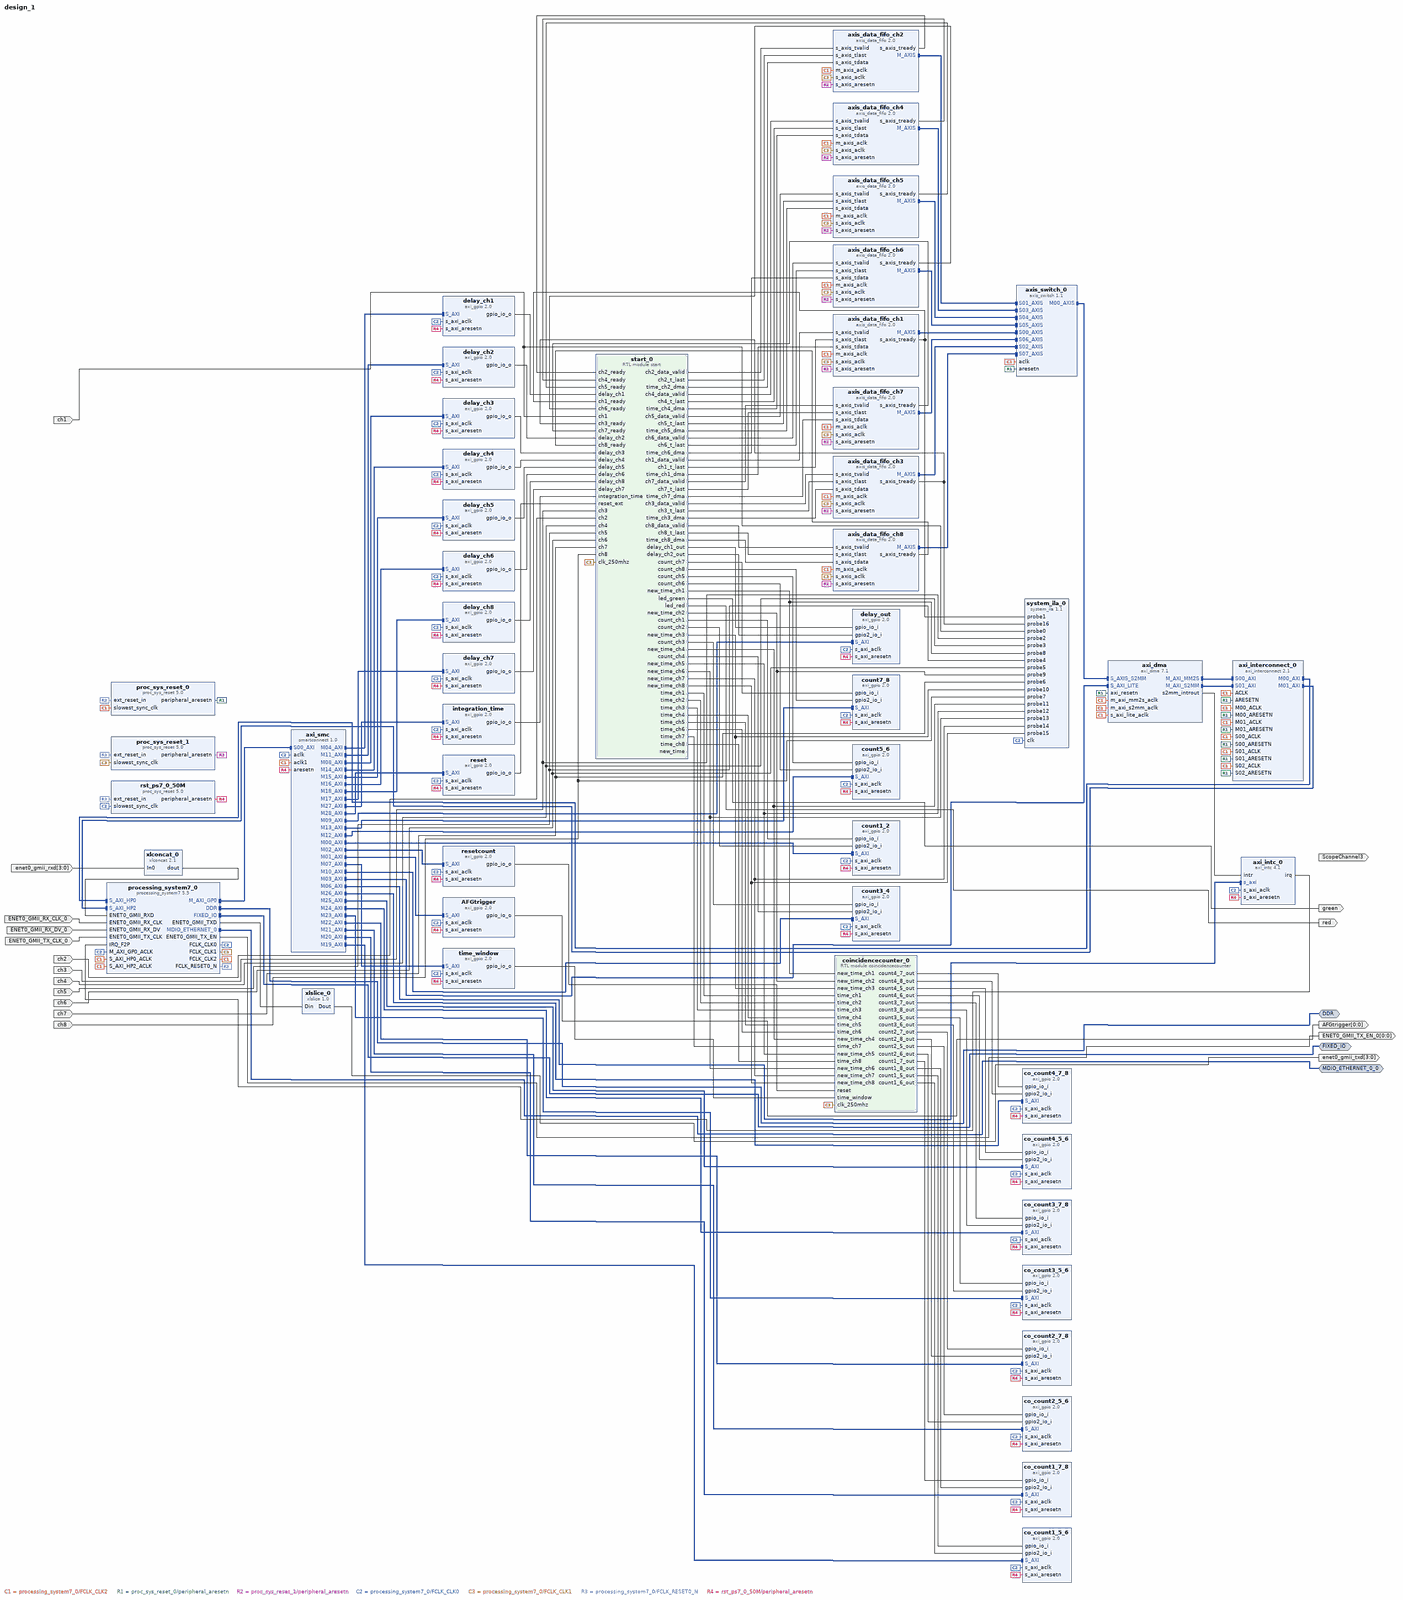
[diagram p0: block diagram of the top level, whole]
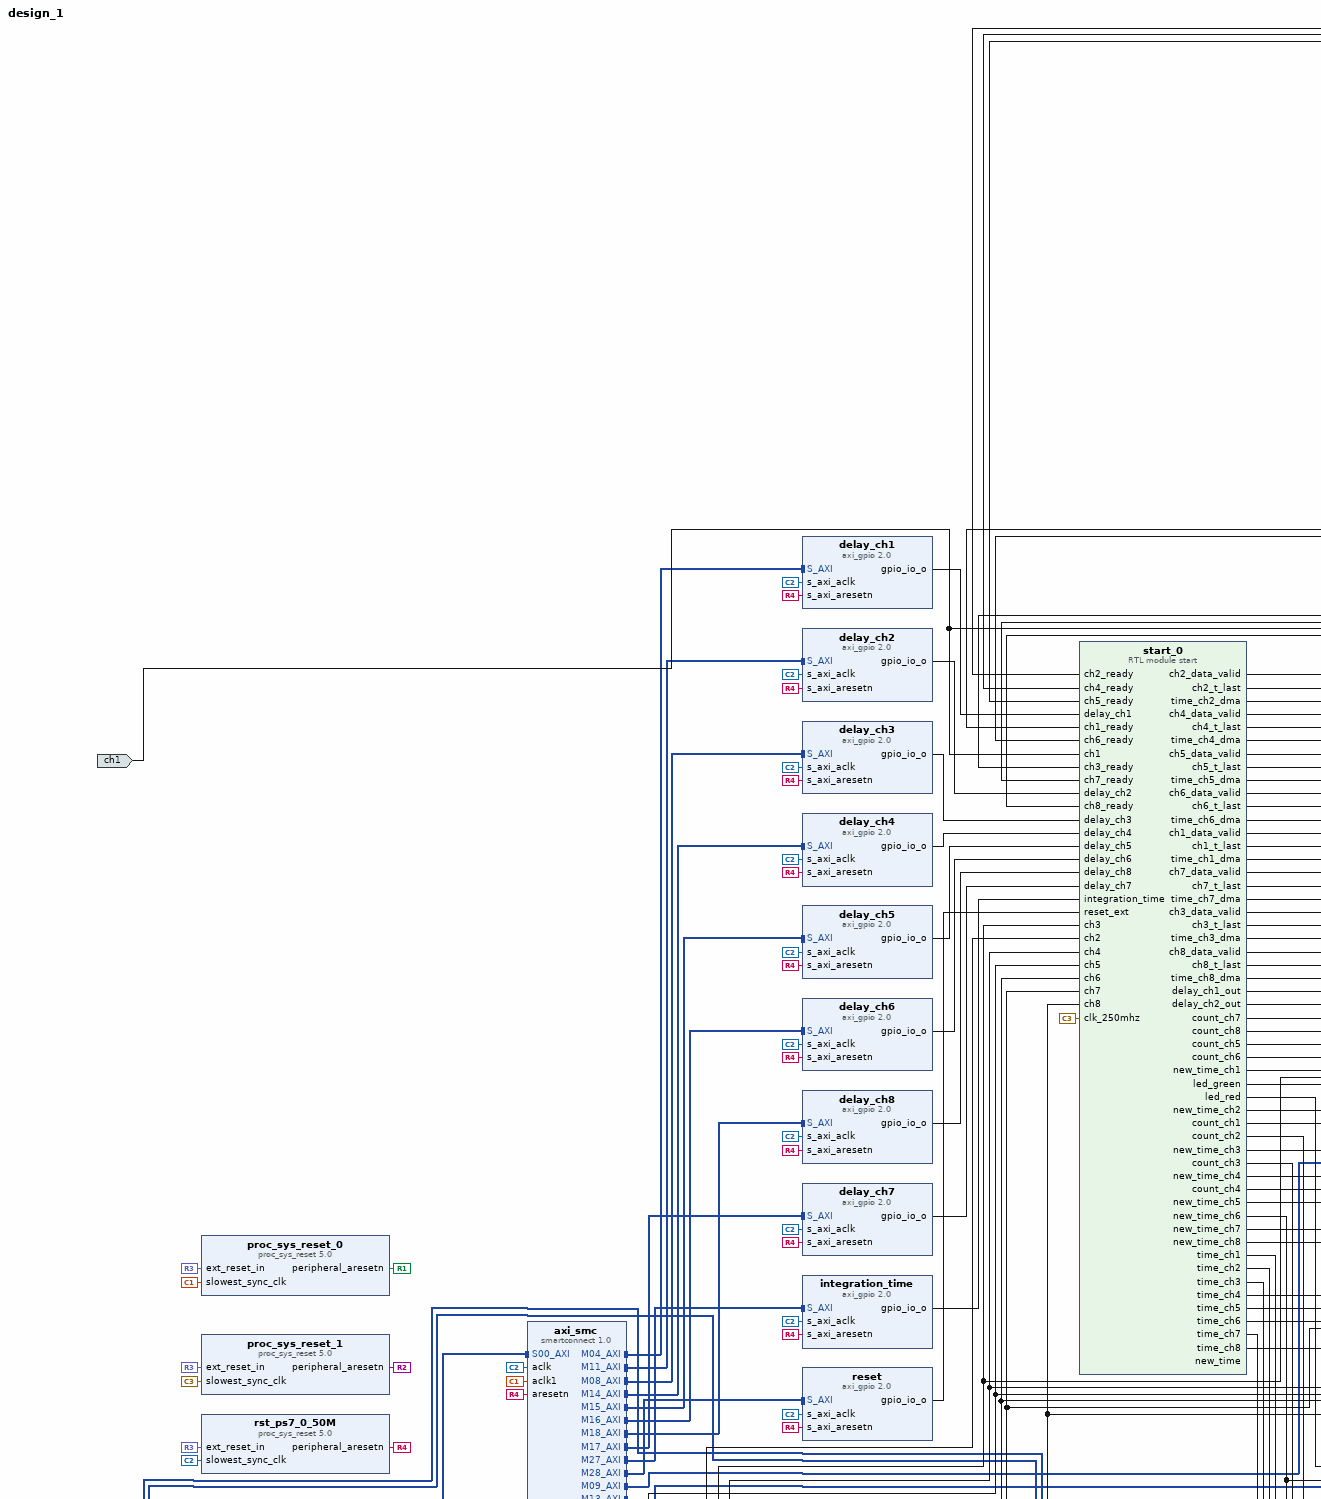
[diagram p1: block diagram of the top level, upper left part]
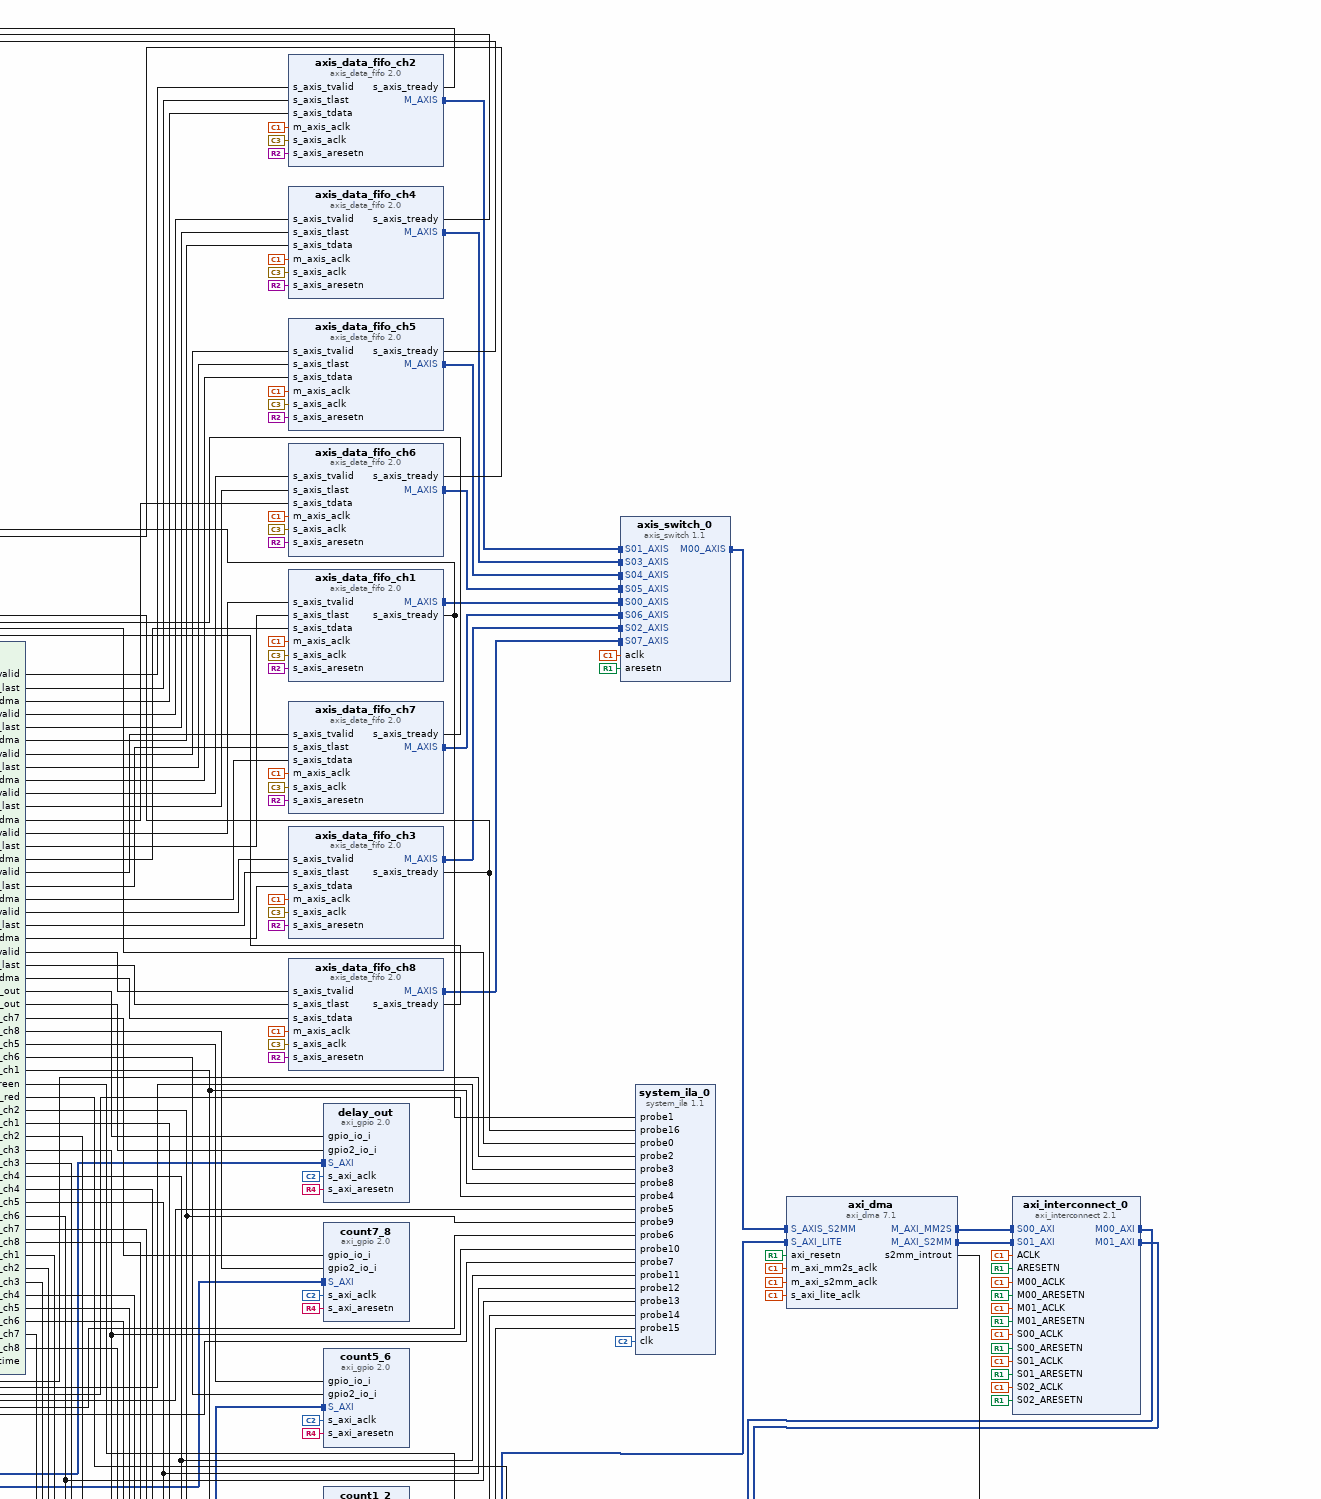
[diagram p2: block diagram of the top level, upper right part]
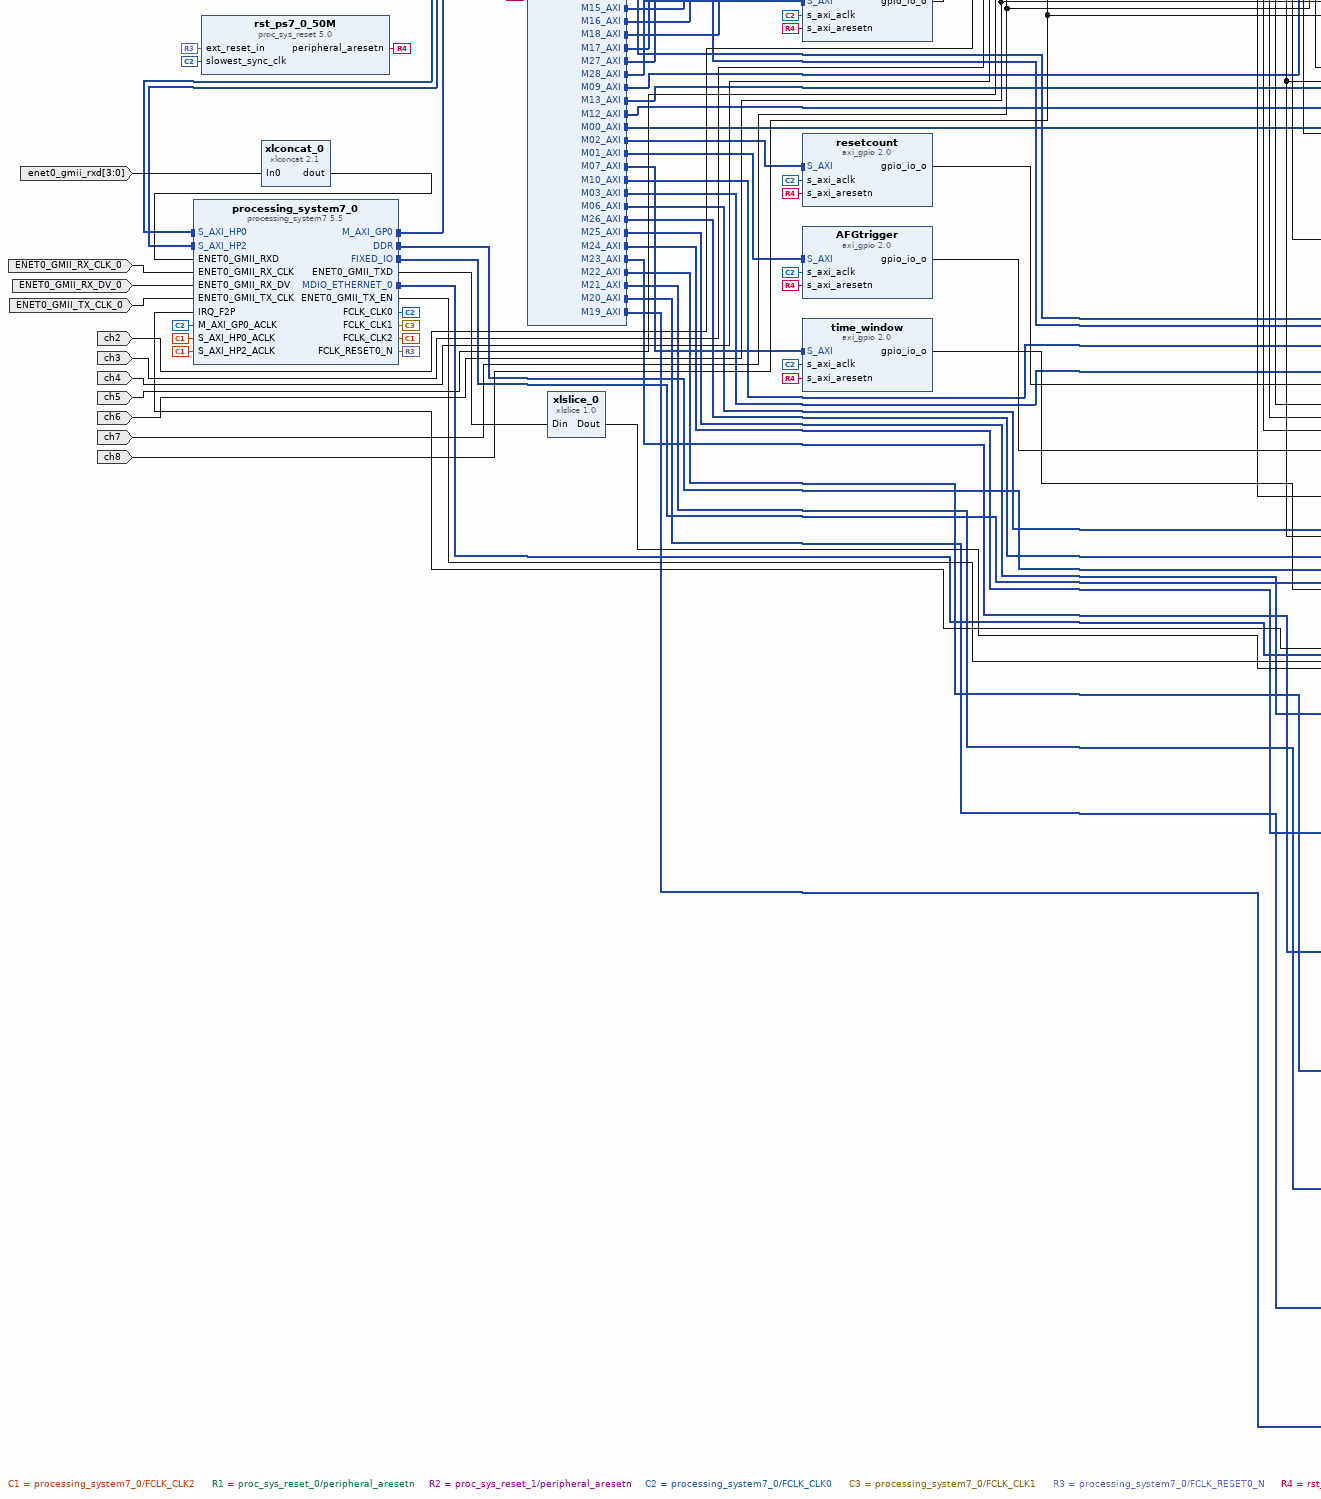
[diagram p3: block diagram of the top level, lower left part]
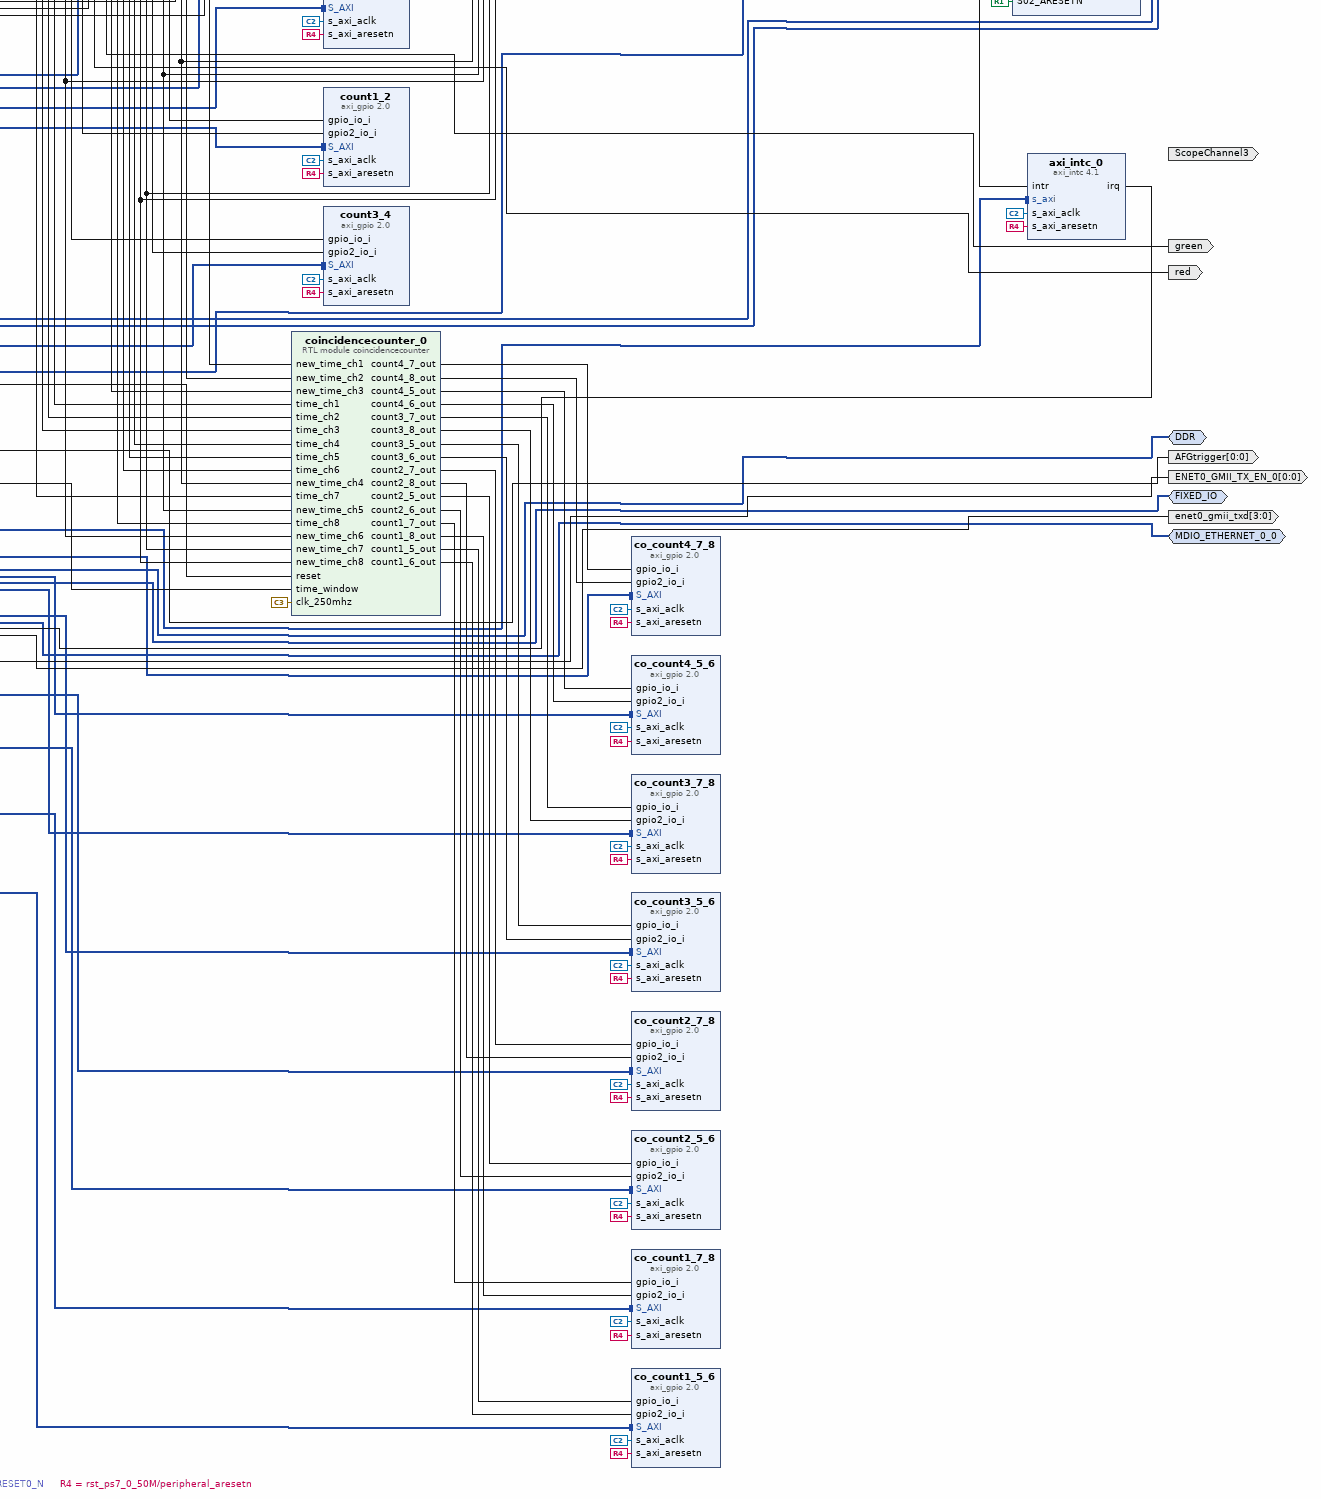
[diagram p4: block diagram of the top level, lower right part]
# Vivado block design design_1, xc7z010clg400-1, Vivado 2025.1
create_bd_design design_1

create_bd_intf_port -mode Master -vlnv xilinx.com:interface:mdio_rtl:1.0 MDIO_ETHERNET_0_0
create_bd_intf_port -mode Master -vlnv xilinx.com:interface:ddrx_rtl:1.0 DDR
create_bd_intf_port -mode Master -vlnv xilinx.com:display_processing_system7:fixedio_rtl:1.0 FIXED_IO
create_bd_port -dir O -from 0 -to 0 ENET0_GMII_TX_EN_0
create_bd_port -dir I -type clk ENET0_GMII_TX_CLK_0
set_property -dict {CONFIG.FREQ_HZ 100000000} [get_bd_ports ENET0_GMII_TX_CLK_0]
create_bd_port -dir I -from 3 -to 0 enet0_gmii_rxd
create_bd_port -dir I ENET0_GMII_RX_DV_0
create_bd_port -dir O -from 3 -to 0 enet0_gmii_txd
create_bd_port -dir I -type clk ENET0_GMII_RX_CLK_0
create_bd_port -dir O green
create_bd_port -dir O red
create_bd_port -dir O ScopeChannel3
create_bd_port -dir O -from 0 -to 0 AFGtrigger
create_bd_port -dir I ch1
create_bd_port -dir I ch2
create_bd_port -dir I ch3
create_bd_port -dir I ch4
create_bd_port -dir I ch5
create_bd_port -dir I ch6
create_bd_port -dir I ch7
create_bd_port -dir I ch8

create_bd_cell -type ip -vlnv xilinx.com:ip:processing_system7:5.5 processing_system7_0
set_property -dict [list \
  CONFIG.PCW_ENET0_ENET0_IO EMIO \
  CONFIG.PCW_ENET0_GRP_MDIO_ENABLE 1 \
  CONFIG.PCW_ENET0_GRP_MDIO_IO EMIO \
  CONFIG.PCW_ENET0_PERIPHERAL_ENABLE 1 \
  CONFIG.PCW_ENET0_PERIPHERAL_FREQMHZ {100 Mbps} \
  CONFIG.PCW_ENET_RESET_ENABLE 0 \
  CONFIG.PCW_EN_CLK1_PORT 1 \
  CONFIG.PCW_EN_CLK2_PORT 1 \
  CONFIG.PCW_FCLK_CLK0_BUF FALSE \
  CONFIG.PCW_FCLK_CLK2_BUF TRUE \
  CONFIG.PCW_FPGA0_PERIPHERAL_FREQMHZ 50 \
  CONFIG.PCW_FPGA1_PERIPHERAL_FREQMHZ 250 \
  CONFIG.PCW_FPGA2_PERIPHERAL_FREQMHZ 125 \
  CONFIG.PCW_FPGA3_PERIPHERAL_FREQMHZ 25 \
  CONFIG.PCW_FPGA_FCLK1_ENABLE 1 \
  CONFIG.PCW_FPGA_FCLK2_ENABLE 1 \
  CONFIG.PCW_GPIO_MIO_GPIO_ENABLE 1 \
  CONFIG.PCW_GPIO_MIO_GPIO_IO MIO \
  CONFIG.PCW_I2C_RESET_ENABLE 0 \
  CONFIG.PCW_IRQ_F2P_INTR 1 \
  CONFIG.PCW_NAND_NAND_IO {MIO 0 2.. 14} \
  CONFIG.PCW_NAND_PERIPHERAL_ENABLE 1 \
  CONFIG.PCW_SD0_GRP_CD_ENABLE 0 \
  CONFIG.PCW_SD0_GRP_WP_ENABLE 0 \
  CONFIG.PCW_SD0_PERIPHERAL_ENABLE 1 \
  CONFIG.PCW_SD0_SD0_IO {MIO 40 .. 45} \
  CONFIG.PCW_SDIO_PERIPHERAL_FREQMHZ 100 \
  CONFIG.PCW_UART1_PERIPHERAL_ENABLE 1 \
  CONFIG.PCW_UART1_UART1_IO {MIO 24 .. 25} \
  CONFIG.PCW_UART_PERIPHERAL_FREQMHZ 100 \
  CONFIG.PCW_UIPARAM_DDR_BUS_WIDTH {16 Bit} \
  CONFIG.PCW_UIPARAM_DDR_PARTNO {MT41K128M16 HA-15E} \
  CONFIG.PCW_USB_RESET_ENABLE 0 \
  CONFIG.PCW_USE_FABRIC_INTERRUPT 1 \
  CONFIG.PCW_USE_S_AXI_HP0 1 \
  CONFIG.PCW_USE_S_AXI_HP2 1 \
] [get_bd_cells processing_system7_0]
# 212 more settings of processing_system7_0 are not shown: defaults, MIO pin electricals, DDR timing, and values the tool derives
create_bd_cell -type ip -vlnv xilinx.com:ip:xlslice:1.0 xlslice_0
set_property -dict {CONFIG.DIN_FROM 3 CONFIG.DIN_WIDTH 8} [get_bd_cells xlslice_0]
create_bd_cell -type ip -vlnv xilinx.com:ip:xlconcat:2.1 xlconcat_0
set_property -dict {CONFIG.IN0_WIDTH 4 CONFIG.IN1_WIDTH 4} [get_bd_cells xlconcat_0]
create_bd_cell -type module -reference start start_0
create_bd_cell -type ip -vlnv xilinx.com:ip:proc_sys_reset:5.0 rst_ps7_0_50M
create_bd_cell -type ip -vlnv xilinx.com:ip:axi_gpio:2.0 delay_ch1
set_property -dict [list \
  CONFIG.C_ALL_INPUTS 0 \
  CONFIG.C_ALL_OUTPUTS 1 \
  CONFIG.C_GPIO_WIDTH 21 \
  CONFIG.C_IS_DUAL 0 \
] [get_bd_cells delay_ch1]
create_bd_cell -type ip -vlnv xilinx.com:ip:axi_gpio:2.0 delay_out
set_property -dict [list \
  CONFIG.C_ALL_INPUTS 1 \
  CONFIG.C_ALL_INPUTS_2 1 \
  CONFIG.C_GPIO2_WIDTH 21 \
  CONFIG.C_GPIO_WIDTH 21 \
  CONFIG.C_IS_DUAL 1 \
] [get_bd_cells delay_out]
create_bd_cell -type ip -vlnv xilinx.com:ip:axi_gpio:2.0 AFGtrigger
set_property -dict [list \
  CONFIG.C_DOUT_DEFAULT 0x00000000 \
  CONFIG.C_GPIO_WIDTH 1 \
  CONFIG.GPIO_BOARD_INTERFACE Custom \
  CONFIG.USE_BOARD_FLOW true \
] [get_bd_cells AFGtrigger]
create_bd_cell -type ip -vlnv xilinx.com:ip:axi_gpio:2.0 count1_2
set_property -dict [list \
  CONFIG.C_ALL_INPUTS 1 \
  CONFIG.C_ALL_INPUTS_2 1 \
  CONFIG.C_GPIO2_WIDTH 22 \
  CONFIG.C_GPIO_WIDTH 22 \
  CONFIG.C_IS_DUAL 1 \
] [get_bd_cells count1_2]
create_bd_cell -type ip -vlnv xilinx.com:ip:axi_gpio:2.0 resetcount
set_property -dict [list \
  CONFIG.C_ALL_INPUTS 0 \
  CONFIG.C_ALL_OUTPUTS 1 \
  CONFIG.C_DOUT_DEFAULT 0x00000000 \
  CONFIG.C_GPIO_WIDTH 1 \
  CONFIG.GPIO_BOARD_INTERFACE Custom \
  CONFIG.USE_BOARD_FLOW true \
] [get_bd_cells resetcount]
create_bd_cell -type ip -vlnv xilinx.com:ip:axi_gpio:2.0 time_window
set_property -dict {CONFIG.C_ALL_INPUTS 0 CONFIG.C_ALL_OUTPUTS 1 CONFIG.C_GPIO_WIDTH 21} [get_bd_cells time_window]
create_bd_cell -type ip -vlnv xilinx.com:ip:axi_gpio:2.0 delay_ch2
set_property -dict {CONFIG.C_ALL_INPUTS 0 CONFIG.C_ALL_OUTPUTS 1 CONFIG.C_GPIO_WIDTH 21} [get_bd_cells delay_ch2]
create_bd_cell -type ip -vlnv xilinx.com:ip:smartconnect:1.0 axi_smc
set_property -dict {CONFIG.NUM_CLKS 2 CONFIG.NUM_MI 29 CONFIG.NUM_SI 1} [get_bd_cells axi_smc]
create_bd_cell -type module -reference coincidencecounter coincidencecounter_0
create_bd_cell -type ip -vlnv xilinx.com:ip:axi_dma:7.1 axi_dma
set_property -dict [list \
  CONFIG.c_include_mm2s_dre 0 \
  CONFIG.c_include_sg 0 \
  CONFIG.c_m_axi_mm2s_data_width 64 \
  CONFIG.c_m_axi_s2mm_data_width 64 \
  CONFIG.c_m_axis_mm2s_tdata_width 32 \
  CONFIG.c_mm2s_burst_size 8 \
  CONFIG.c_s2mm_burst_size 16 \
  CONFIG.c_s_axis_s2mm_tdata_width 64 \
  CONFIG.c_sg_length_width 26 \
] [get_bd_cells axi_dma]
create_bd_cell -type ip -vlnv xilinx.com:ip:proc_sys_reset:5.0 proc_sys_reset_0
create_bd_cell -type ip -vlnv xilinx.com:ip:proc_sys_reset:5.0 proc_sys_reset_1
create_bd_cell -type ip -vlnv xilinx.com:ip:axis_switch:1.1 axis_switch_0
set_property -dict {CONFIG.NUM_SI 8} [get_bd_cells axis_switch_0]
create_bd_cell -type ip -vlnv xilinx.com:ip:axi_interconnect:2.1 axi_interconnect_0
set_property -dict {CONFIG.NUM_MI 2 CONFIG.NUM_SI 3} [get_bd_cells axi_interconnect_0]
create_bd_cell -type ip -vlnv xilinx.com:ip:axis_data_fifo:2.0 axis_data_fifo_ch1
set_property -dict [list \
  CONFIG.ACLKEN_CONV_MODE 0 \
  CONFIG.FIFO_DEPTH 32 \
  CONFIG.HAS_TLAST 1 \
  CONFIG.IS_ACLK_ASYNC 1 \
  CONFIG.TDATA_NUM_BYTES 8 \
] [get_bd_cells axis_data_fifo_ch1]
create_bd_cell -type ip -vlnv xilinx.com:ip:axis_data_fifo:2.0 axis_data_fifo_ch2
set_property -dict [list \
  CONFIG.FIFO_DEPTH 32 \
  CONFIG.HAS_TLAST 1 \
  CONFIG.IS_ACLK_ASYNC 1 \
  CONFIG.TDATA_NUM_BYTES 8 \
] [get_bd_cells axis_data_fifo_ch2]
create_bd_cell -type ip -vlnv xilinx.com:ip:axi_intc:4.1 axi_intc_0
create_bd_cell -type ip -vlnv xilinx.com:ip:axi_gpio:2.0 delay_ch3
set_property -dict {CONFIG.C_ALL_OUTPUTS 1 CONFIG.C_GPIO_WIDTH 21} [get_bd_cells delay_ch3]
create_bd_cell -type ip -vlnv xilinx.com:ip:axi_gpio:2.0 delay_ch4
set_property -dict {CONFIG.C_ALL_OUTPUTS 1 CONFIG.C_GPIO_WIDTH 21} [get_bd_cells delay_ch4]
create_bd_cell -type ip -vlnv xilinx.com:ip:axi_gpio:2.0 delay_ch5
set_property -dict {CONFIG.C_ALL_OUTPUTS 1 CONFIG.C_GPIO_WIDTH 21} [get_bd_cells delay_ch5]
create_bd_cell -type ip -vlnv xilinx.com:ip:axi_gpio:2.0 delay_ch6
set_property -dict {CONFIG.C_ALL_OUTPUTS 1 CONFIG.C_GPIO_WIDTH 21} [get_bd_cells delay_ch6]
create_bd_cell -type ip -vlnv xilinx.com:ip:axi_gpio:2.0 delay_ch7
set_property -dict {CONFIG.C_ALL_OUTPUTS 1 CONFIG.C_GPIO_WIDTH 21} [get_bd_cells delay_ch7]
create_bd_cell -type ip -vlnv xilinx.com:ip:axi_gpio:2.0 delay_ch8
set_property -dict {CONFIG.C_ALL_OUTPUTS 1 CONFIG.C_GPIO_WIDTH 21} [get_bd_cells delay_ch8]
create_bd_cell -type ip -vlnv xilinx.com:ip:axi_gpio:2.0 count3_4
set_property -dict [list \
  CONFIG.C_ALL_INPUTS 1 \
  CONFIG.C_ALL_INPUTS_2 1 \
  CONFIG.C_GPIO2_WIDTH 22 \
  CONFIG.C_GPIO_WIDTH 22 \
  CONFIG.C_IS_DUAL 1 \
] [get_bd_cells count3_4]
create_bd_cell -type ip -vlnv xilinx.com:ip:axi_gpio:2.0 count5_6
set_property -dict [list \
  CONFIG.C_ALL_INPUTS 1 \
  CONFIG.C_ALL_INPUTS_2 1 \
  CONFIG.C_GPIO2_WIDTH 22 \
  CONFIG.C_GPIO_WIDTH 22 \
  CONFIG.C_IS_DUAL 1 \
] [get_bd_cells count5_6]
create_bd_cell -type ip -vlnv xilinx.com:ip:axi_gpio:2.0 count7_8
set_property -dict [list \
  CONFIG.C_ALL_INPUTS 1 \
  CONFIG.C_ALL_INPUTS_2 1 \
  CONFIG.C_GPIO2_WIDTH 22 \
  CONFIG.C_GPIO_WIDTH 22 \
  CONFIG.C_IS_DUAL 1 \
] [get_bd_cells count7_8]
create_bd_cell -type ip -vlnv xilinx.com:ip:axi_gpio:2.0 co_count1_5_6
set_property -dict [list \
  CONFIG.C_ALL_INPUTS 1 \
  CONFIG.C_ALL_INPUTS_2 1 \
  CONFIG.C_GPIO2_WIDTH 22 \
  CONFIG.C_GPIO_WIDTH 22 \
  CONFIG.C_IS_DUAL 1 \
] [get_bd_cells co_count1_5_6]
create_bd_cell -type ip -vlnv xilinx.com:ip:axi_gpio:2.0 co_count1_7_8
set_property -dict [list \
  CONFIG.C_ALL_INPUTS 1 \
  CONFIG.C_ALL_INPUTS_2 1 \
  CONFIG.C_GPIO2_WIDTH 22 \
  CONFIG.C_GPIO_WIDTH 22 \
  CONFIG.C_IS_DUAL 1 \
] [get_bd_cells co_count1_7_8]
create_bd_cell -type ip -vlnv xilinx.com:ip:axi_gpio:2.0 co_count2_5_6
set_property -dict [list \
  CONFIG.C_ALL_INPUTS 1 \
  CONFIG.C_ALL_INPUTS_2 1 \
  CONFIG.C_GPIO2_WIDTH 22 \
  CONFIG.C_GPIO_WIDTH 22 \
  CONFIG.C_IS_DUAL 1 \
] [get_bd_cells co_count2_5_6]
create_bd_cell -type ip -vlnv xilinx.com:ip:axi_gpio:2.0 co_count2_7_8
set_property -dict [list \
  CONFIG.C_ALL_INPUTS 1 \
  CONFIG.C_ALL_INPUTS_2 1 \
  CONFIG.C_GPIO2_WIDTH 22 \
  CONFIG.C_GPIO_WIDTH 22 \
  CONFIG.C_IS_DUAL 1 \
] [get_bd_cells co_count2_7_8]
create_bd_cell -type ip -vlnv xilinx.com:ip:axi_gpio:2.0 co_count3_5_6
set_property -dict [list \
  CONFIG.C_ALL_INPUTS 1 \
  CONFIG.C_ALL_INPUTS_2 1 \
  CONFIG.C_GPIO2_WIDTH 22 \
  CONFIG.C_GPIO_WIDTH 22 \
  CONFIG.C_IS_DUAL 1 \
] [get_bd_cells co_count3_5_6]
create_bd_cell -type ip -vlnv xilinx.com:ip:axi_gpio:2.0 co_count3_7_8
set_property -dict [list \
  CONFIG.C_ALL_INPUTS 1 \
  CONFIG.C_ALL_INPUTS_2 1 \
  CONFIG.C_GPIO2_WIDTH 22 \
  CONFIG.C_GPIO_WIDTH 22 \
  CONFIG.C_IS_DUAL 1 \
] [get_bd_cells co_count3_7_8]
create_bd_cell -type ip -vlnv xilinx.com:ip:axi_gpio:2.0 co_count4_5_6
set_property -dict [list \
  CONFIG.C_ALL_INPUTS 1 \
  CONFIG.C_ALL_INPUTS_2 1 \
  CONFIG.C_GPIO2_WIDTH 22 \
  CONFIG.C_GPIO_WIDTH 22 \
  CONFIG.C_IS_DUAL 1 \
] [get_bd_cells co_count4_5_6]
create_bd_cell -type ip -vlnv xilinx.com:ip:axi_gpio:2.0 co_count4_7_8
set_property -dict [list \
  CONFIG.C_ALL_INPUTS 1 \
  CONFIG.C_ALL_INPUTS_2 1 \
  CONFIG.C_GPIO2_WIDTH 22 \
  CONFIG.C_GPIO_WIDTH 22 \
  CONFIG.C_IS_DUAL 1 \
] [get_bd_cells co_count4_7_8]
create_bd_cell -type ip -vlnv xilinx.com:ip:axis_data_fifo:2.0 axis_data_fifo_ch3
set_property -dict [list \
  CONFIG.ACLKEN_CONV_MODE 0 \
  CONFIG.FIFO_DEPTH 32 \
  CONFIG.HAS_TLAST 1 \
  CONFIG.IS_ACLK_ASYNC 1 \
  CONFIG.TDATA_NUM_BYTES 8 \
] [get_bd_cells axis_data_fifo_ch3]
create_bd_cell -type ip -vlnv xilinx.com:ip:axis_data_fifo:2.0 axis_data_fifo_ch4
set_property -dict [list \
  CONFIG.ACLKEN_CONV_MODE 0 \
  CONFIG.FIFO_DEPTH 32 \
  CONFIG.HAS_TLAST 1 \
  CONFIG.IS_ACLK_ASYNC 1 \
  CONFIG.TDATA_NUM_BYTES 8 \
] [get_bd_cells axis_data_fifo_ch4]
create_bd_cell -type ip -vlnv xilinx.com:ip:axis_data_fifo:2.0 axis_data_fifo_ch5
set_property -dict [list \
  CONFIG.ACLKEN_CONV_MODE 0 \
  CONFIG.FIFO_DEPTH 32 \
  CONFIG.HAS_TLAST 1 \
  CONFIG.IS_ACLK_ASYNC 1 \
  CONFIG.TDATA_NUM_BYTES 8 \
] [get_bd_cells axis_data_fifo_ch5]
create_bd_cell -type ip -vlnv xilinx.com:ip:axis_data_fifo:2.0 axis_data_fifo_ch6
set_property -dict [list \
  CONFIG.ACLKEN_CONV_MODE 0 \
  CONFIG.FIFO_DEPTH 32 \
  CONFIG.HAS_TLAST 1 \
  CONFIG.IS_ACLK_ASYNC 1 \
  CONFIG.TDATA_NUM_BYTES 8 \
] [get_bd_cells axis_data_fifo_ch6]
create_bd_cell -type ip -vlnv xilinx.com:ip:axis_data_fifo:2.0 axis_data_fifo_ch7
set_property -dict [list \
  CONFIG.ACLKEN_CONV_MODE 0 \
  CONFIG.FIFO_DEPTH 32 \
  CONFIG.HAS_TLAST 1 \
  CONFIG.IS_ACLK_ASYNC 1 \
  CONFIG.TDATA_NUM_BYTES 8 \
] [get_bd_cells axis_data_fifo_ch7]
create_bd_cell -type ip -vlnv xilinx.com:ip:axis_data_fifo:2.0 axis_data_fifo_ch8
set_property -dict [list \
  CONFIG.ACLKEN_CONV_MODE 0 \
  CONFIG.FIFO_DEPTH 32 \
  CONFIG.HAS_TLAST 1 \
  CONFIG.IS_ACLK_ASYNC 1 \
  CONFIG.TDATA_NUM_BYTES 8 \
] [get_bd_cells axis_data_fifo_ch8]
create_bd_cell -type ip -vlnv xilinx.com:ip:axi_gpio:2.0 reset
set_property -dict {CONFIG.C_ALL_OUTPUTS 1 CONFIG.C_GPIO_WIDTH 1} [get_bd_cells reset]
create_bd_cell -type ip -vlnv xilinx.com:ip:axi_gpio:2.0 integration_time
set_property -dict {CONFIG.C_ALL_OUTPUTS 1} [get_bd_cells integration_time]
create_bd_cell -type ip -vlnv xilinx.com:ip:system_ila:1.1 system_ila_0
set_property -dict [list \
  CONFIG.C_MON_TYPE NATIVE \
  CONFIG.C_NUM_OF_PROBES 17 \
  CONFIG.C_PROBE0_TYPE 0 \
  CONFIG.C_PROBE10_TYPE 0 \
  CONFIG.C_PROBE11_TYPE 0 \
  CONFIG.C_PROBE12_TYPE 0 \
  CONFIG.C_PROBE13_TYPE 0 \
  CONFIG.C_PROBE14_TYPE 0 \
  CONFIG.C_PROBE15_TYPE 0 \
  CONFIG.C_PROBE16_TYPE 0 \
  CONFIG.C_PROBE1_TYPE 0 \
  CONFIG.C_PROBE2_TYPE 0 \
  CONFIG.C_PROBE3_TYPE 0 \
  CONFIG.C_PROBE4_TYPE 0 \
  CONFIG.C_PROBE5_TYPE 0 \
  CONFIG.C_PROBE6_TYPE 0 \
  CONFIG.C_PROBE7_TYPE 0 \
  CONFIG.C_PROBE8_TYPE 0 \
  CONFIG.C_PROBE9_TYPE 0 \
] [get_bd_cells system_ila_0]

# ---- connections ----

connect_bd_intf_net [get_bd_intf_pins axi_dma/M_AXI_MM2S] [get_bd_intf_pins axi_interconnect_0/S00_AXI]
connect_bd_intf_net [get_bd_intf_pins axi_dma/M_AXI_S2MM] [get_bd_intf_pins axi_interconnect_0/S01_AXI]
connect_bd_intf_net [get_bd_intf_pins axi_interconnect_0/M00_AXI] [get_bd_intf_pins processing_system7_0/S_AXI_HP0]
connect_bd_intf_net [get_bd_intf_pins processing_system7_0/S_AXI_HP2] [get_bd_intf_pins axi_interconnect_0/M01_AXI]
connect_bd_intf_net [get_bd_intf_pins axi_smc/M00_AXI] [get_bd_intf_pins count1_2/S_AXI]
connect_bd_intf_net [get_bd_intf_pins axi_smc/M01_AXI] [get_bd_intf_pins AFGtrigger/S_AXI]
connect_bd_intf_net [get_bd_intf_pins axi_smc/M02_AXI] [get_bd_intf_pins resetcount/S_AXI]
connect_bd_intf_net [get_bd_intf_pins axi_smc/M03_AXI] [get_bd_intf_pins axi_dma/S_AXI_LITE]
connect_bd_intf_net [get_bd_intf_pins axi_smc/M04_AXI] [get_bd_intf_pins delay_ch1/S_AXI]
connect_bd_intf_net [get_bd_intf_pins axi_intc_0/s_axi] [get_bd_intf_pins axi_smc/M06_AXI]
connect_bd_intf_net [get_bd_intf_pins axi_smc/M07_AXI] [get_bd_intf_pins time_window/S_AXI]
connect_bd_intf_net [get_bd_intf_pins axi_smc/M08_AXI] [get_bd_intf_pins delay_ch3/S_AXI]
connect_bd_intf_net [get_bd_intf_pins axi_smc/M09_AXI] [get_bd_intf_pins delay_out/S_AXI]
connect_bd_intf_net [get_bd_intf_pins axi_smc/M10_AXI] [get_bd_intf_pins count3_4/S_AXI]
connect_bd_intf_net [get_bd_intf_pins axi_smc/M11_AXI] [get_bd_intf_pins delay_ch2/S_AXI]
connect_bd_intf_net [get_bd_intf_pins axi_smc/M12_AXI] [get_bd_intf_pins count5_6/S_AXI]
connect_bd_intf_net [get_bd_intf_pins axi_smc/M13_AXI] [get_bd_intf_pins count7_8/S_AXI]
connect_bd_intf_net [get_bd_intf_pins axi_smc/M14_AXI] [get_bd_intf_pins delay_ch4/S_AXI]
connect_bd_intf_net [get_bd_intf_pins axi_smc/M15_AXI] [get_bd_intf_pins delay_ch5/S_AXI]
connect_bd_intf_net [get_bd_intf_pins axi_smc/M16_AXI] [get_bd_intf_pins delay_ch6/S_AXI]
connect_bd_intf_net [get_bd_intf_pins axi_smc/M17_AXI] [get_bd_intf_pins delay_ch7/S_AXI]
connect_bd_intf_net [get_bd_intf_pins axi_smc/M18_AXI] [get_bd_intf_pins delay_ch8/S_AXI]
connect_bd_intf_net [get_bd_intf_pins axi_smc/M19_AXI] [get_bd_intf_pins co_count1_5_6/S_AXI]
connect_bd_intf_net [get_bd_intf_pins axi_smc/M20_AXI] [get_bd_intf_pins co_count1_7_8/S_AXI]
connect_bd_intf_net [get_bd_intf_pins axi_smc/M21_AXI] [get_bd_intf_pins co_count2_5_6/S_AXI]
connect_bd_intf_net [get_bd_intf_pins axi_smc/M22_AXI] [get_bd_intf_pins co_count2_7_8/S_AXI]
connect_bd_intf_net [get_bd_intf_pins axi_smc/M23_AXI] [get_bd_intf_pins co_count3_5_6/S_AXI]
connect_bd_intf_net [get_bd_intf_pins axi_smc/M24_AXI] [get_bd_intf_pins co_count3_7_8/S_AXI]
connect_bd_intf_net [get_bd_intf_pins axi_smc/M25_AXI] [get_bd_intf_pins co_count4_5_6/S_AXI]
connect_bd_intf_net [get_bd_intf_pins axi_smc/M26_AXI] [get_bd_intf_pins co_count4_7_8/S_AXI]
connect_bd_intf_net [get_bd_intf_pins axi_smc/M27_AXI] [get_bd_intf_pins integration_time/S_AXI]
connect_bd_intf_net [get_bd_intf_pins axi_smc/M28_AXI] [get_bd_intf_pins reset/S_AXI]
connect_bd_intf_net -intf_net axis_data_fifo_0_M_AXIS [get_bd_intf_pins axis_data_fifo_ch1/M_AXIS] [get_bd_intf_pins axis_switch_0/S00_AXIS]
connect_bd_intf_net -intf_net axis_data_fifo_0_M_AXIS1 [get_bd_intf_pins axis_data_fifo_ch2/M_AXIS] [get_bd_intf_pins axis_switch_0/S01_AXIS]
connect_bd_intf_net [get_bd_intf_pins axis_data_fifo_ch3/M_AXIS] [get_bd_intf_pins axis_switch_0/S02_AXIS]
connect_bd_intf_net [get_bd_intf_pins axis_data_fifo_ch4/M_AXIS] [get_bd_intf_pins axis_switch_0/S03_AXIS]
connect_bd_intf_net [get_bd_intf_pins axis_data_fifo_ch5/M_AXIS] [get_bd_intf_pins axis_switch_0/S04_AXIS]
connect_bd_intf_net [get_bd_intf_pins axis_data_fifo_ch6/M_AXIS] [get_bd_intf_pins axis_switch_0/S05_AXIS]
connect_bd_intf_net [get_bd_intf_pins axis_data_fifo_ch7/M_AXIS] [get_bd_intf_pins axis_switch_0/S06_AXIS]
connect_bd_intf_net [get_bd_intf_pins axis_data_fifo_ch8/M_AXIS] [get_bd_intf_pins axis_switch_0/S07_AXIS]
connect_bd_intf_net [get_bd_intf_pins axis_switch_0/M00_AXIS] [get_bd_intf_pins axi_dma/S_AXIS_S2MM]
connect_bd_intf_net [get_bd_intf_ports DDR] [get_bd_intf_pins processing_system7_0/DDR]
connect_bd_intf_net [get_bd_intf_ports FIXED_IO] [get_bd_intf_pins processing_system7_0/FIXED_IO]
connect_bd_intf_net [get_bd_intf_ports MDIO_ETHERNET_0_0] [get_bd_intf_pins processing_system7_0/MDIO_ETHERNET_0]
connect_bd_intf_net [get_bd_intf_pins processing_system7_0/M_AXI_GP0] [get_bd_intf_pins axi_smc/S00_AXI]
connect_bd_net [get_bd_pins AFGtrigger/gpio_io_o] [get_bd_ports AFGtrigger]
connect_bd_net -net ENET0_GMII_RX_CLK_0_1 [get_bd_ports ENET0_GMII_RX_CLK_0] [get_bd_pins processing_system7_0/ENET0_GMII_RX_CLK]
connect_bd_net -net ENET0_GMII_RX_DV_0_1 [get_bd_ports ENET0_GMII_RX_DV_0] [get_bd_pins processing_system7_0/ENET0_GMII_RX_DV]
connect_bd_net -net ENET0_GMII_TX_CLK_0_1 [get_bd_ports ENET0_GMII_TX_CLK_0] [get_bd_pins processing_system7_0/ENET0_GMII_TX_CLK]
connect_bd_net -net In0_0_1 [get_bd_ports enet0_gmii_rxd] [get_bd_pins xlconcat_0/In0]
connect_bd_net [get_bd_pins processing_system7_0/FCLK_CLK2] \
  [get_bd_pins axi_dma/s_axi_lite_aclk] [get_bd_pins axi_dma/m_axi_mm2s_aclk] [get_bd_pins axi_dma/m_axi_s2mm_aclk] \
  [get_bd_pins processing_system7_0/S_AXI_HP0_ACLK] [get_bd_pins processing_system7_0/S_AXI_HP2_ACLK] \
  [get_bd_pins proc_sys_reset_0/slowest_sync_clk] [get_bd_pins axi_smc/aclk1] [get_bd_pins axis_switch_0/aclk] \
  [get_bd_pins axi_interconnect_0/S02_ACLK] [get_bd_pins axi_interconnect_0/M00_ACLK] [get_bd_pins axi_interconnect_0/ACLK] \
  [get_bd_pins axi_interconnect_0/M01_ACLK] [get_bd_pins axi_interconnect_0/S00_ACLK] \
  [get_bd_pins axi_interconnect_0/S01_ACLK] [get_bd_pins axis_data_fifo_ch1/m_axis_aclk] \
  [get_bd_pins axis_data_fifo_ch2/m_axis_aclk] [get_bd_pins axis_data_fifo_ch3/m_axis_aclk] \
  [get_bd_pins axis_data_fifo_ch4/m_axis_aclk] [get_bd_pins axis_data_fifo_ch5/m_axis_aclk] \
  [get_bd_pins axis_data_fifo_ch6/m_axis_aclk] [get_bd_pins axis_data_fifo_ch7/m_axis_aclk] \
  [get_bd_pins axis_data_fifo_ch8/m_axis_aclk]
connect_bd_net [get_bd_pins proc_sys_reset_0/peripheral_aresetn] \
  [get_bd_pins axi_dma/axi_resetn] [get_bd_pins axis_switch_0/aresetn] [get_bd_pins axi_interconnect_0/S02_ARESETN] \
  [get_bd_pins axi_interconnect_0/M00_ARESETN] [get_bd_pins axi_interconnect_0/ARESETN] \
  [get_bd_pins axi_interconnect_0/M01_ARESETN] [get_bd_pins axi_interconnect_0/S00_ARESETN] \
  [get_bd_pins axi_interconnect_0/S01_ARESETN]
connect_bd_net [get_bd_pins axi_dma/s2mm_introut] [get_bd_pins axi_intc_0/intr]
connect_bd_net -net axi_gpio_1_gpio_io_o [get_bd_pins delay_ch8/gpio_io_o] [get_bd_pins start_0/delay_ch8]
connect_bd_net [get_bd_pins axi_intc_0/irq] [get_bd_pins processing_system7_0/IRQ_F2P]
connect_bd_net -net axis_data_fifo_0_s_axis_tready [get_bd_pins axis_data_fifo_ch1/s_axis_tready] \
  [get_bd_pins system_ila_0/probe1] [get_bd_pins start_0/ch1_ready]
connect_bd_net -net axis_data_fifo_0_s_axis_tready1 [get_bd_pins axis_data_fifo_ch2/s_axis_tready] [get_bd_pins start_0/ch2_ready]
connect_bd_net -net axis_data_fifo_ch3_s_axis_tready [get_bd_pins axis_data_fifo_ch3/s_axis_tready] \
  [get_bd_pins start_0/ch3_ready] [get_bd_pins system_ila_0/probe16]
connect_bd_net [get_bd_pins axis_data_fifo_ch4/s_axis_tready] [get_bd_pins start_0/ch4_ready]
connect_bd_net [get_bd_pins axis_data_fifo_ch5/s_axis_tready] [get_bd_pins start_0/ch5_ready]
connect_bd_net [get_bd_pins axis_data_fifo_ch6/s_axis_tready] [get_bd_pins start_0/ch6_ready]
connect_bd_net [get_bd_pins axis_data_fifo_ch7/s_axis_tready] [get_bd_pins start_0/ch7_ready]
connect_bd_net [get_bd_pins axis_data_fifo_ch8/s_axis_tready] [get_bd_pins start_0/ch8_ready]
connect_bd_net -net ch1_0_1 [get_bd_ports ch1] [get_bd_pins system_ila_0/probe0] [get_bd_pins start_0/ch1]
connect_bd_net -net ch2_0_1 [get_bd_ports ch2] [get_bd_pins start_0/ch2]
connect_bd_net -net ch3_0_1 [get_bd_ports ch3] [get_bd_pins system_ila_0/probe2] [get_bd_pins start_0/ch3]
connect_bd_net -net ch4_0_1 [get_bd_ports ch4] [get_bd_pins system_ila_0/probe3] [get_bd_pins start_0/ch4]
connect_bd_net -net ch5_0_1 [get_bd_ports ch5] [get_bd_pins system_ila_0/probe4] [get_bd_pins start_0/ch5]
connect_bd_net -net ch6_0_1 [get_bd_ports ch6] [get_bd_pins system_ila_0/probe5] [get_bd_pins start_0/ch6]
connect_bd_net -net ch7_0_1 [get_bd_ports ch7] [get_bd_pins system_ila_0/probe6] [get_bd_pins start_0/ch7]
connect_bd_net -net ch8_0_1 [get_bd_ports ch8] [get_bd_pins system_ila_0/probe7] [get_bd_pins start_0/ch8]
connect_bd_net -net coincidencecounter_0_count1_5 [get_bd_pins coincidencecounter_0/count1_5_out] [get_bd_pins co_count1_5_6/gpio_io_i]
connect_bd_net -net coincidencecounter_0_count1_6 [get_bd_pins coincidencecounter_0/count1_6_out] [get_bd_pins co_count1_5_6/gpio2_io_i]
connect_bd_net -net coincidencecounter_0_count1_7 [get_bd_pins coincidencecounter_0/count1_7_out] [get_bd_pins co_count1_7_8/gpio_io_i]
connect_bd_net -net coincidencecounter_0_count1_8 [get_bd_pins coincidencecounter_0/count1_8_out] [get_bd_pins co_count1_7_8/gpio2_io_i]
connect_bd_net -net coincidencecounter_0_count2_5 [get_bd_pins coincidencecounter_0/count2_5_out] [get_bd_pins co_count2_5_6/gpio_io_i]
connect_bd_net -net coincidencecounter_0_count2_6 [get_bd_pins coincidencecounter_0/count2_6_out] [get_bd_pins co_count2_5_6/gpio2_io_i]
connect_bd_net -net coincidencecounter_0_count2_7 [get_bd_pins coincidencecounter_0/count2_7_out] [get_bd_pins co_count2_7_8/gpio_io_i]
connect_bd_net -net coincidencecounter_0_count2_8 [get_bd_pins coincidencecounter_0/count2_8_out] [get_bd_pins co_count2_7_8/gpio2_io_i]
connect_bd_net -net coincidencecounter_0_count3_5 [get_bd_pins coincidencecounter_0/count3_5_out] [get_bd_pins co_count3_5_6/gpio_io_i]
connect_bd_net -net coincidencecounter_0_count3_6 [get_bd_pins coincidencecounter_0/count3_6_out] [get_bd_pins co_count3_5_6/gpio2_io_i]
connect_bd_net -net coincidencecounter_0_count3_7 [get_bd_pins coincidencecounter_0/count3_7_out] [get_bd_pins co_count3_7_8/gpio_io_i]
connect_bd_net -net coincidencecounter_0_count3_8 [get_bd_pins coincidencecounter_0/count3_8_out] [get_bd_pins co_count3_7_8/gpio2_io_i]
connect_bd_net [get_bd_pins coincidencecounter_0/count4_5_out] [get_bd_pins co_count4_5_6/gpio_io_i]
connect_bd_net -net coincidencecounter_0_count4_6 [get_bd_pins coincidencecounter_0/count4_6_out] [get_bd_pins co_count4_5_6/gpio2_io_i]
connect_bd_net -net coincidencecounter_0_count4_7 [get_bd_pins coincidencecounter_0/count4_7_out] [get_bd_pins co_count4_7_8/gpio_io_i]
connect_bd_net -net coincidencecounter_0_count4_8 [get_bd_pins coincidencecounter_0/count4_8_out] [get_bd_pins co_count4_7_8/gpio2_io_i]
connect_bd_net [get_bd_pins delay_ch2/gpio_io_o] [get_bd_pins start_0/delay_ch2]
connect_bd_net -net delay_ch3 [get_bd_pins delay_ch3/gpio_io_o] [get_bd_pins start_0/delay_ch3]
connect_bd_net [get_bd_pins delay_ch4/gpio_io_o] [get_bd_pins start_0/delay_ch4]
connect_bd_net [get_bd_pins delay_ch5/gpio_io_o] [get_bd_pins start_0/delay_ch5]
connect_bd_net [get_bd_pins delay_ch6/gpio_io_o] [get_bd_pins start_0/delay_ch6]
connect_bd_net [get_bd_pins delay_ch7/gpio_io_o] [get_bd_pins start_0/delay_ch7]
connect_bd_net -net delay_gpio_io_o [get_bd_pins delay_ch1/gpio_io_o] [get_bd_pins start_0/delay_ch1]
connect_bd_net [get_bd_pins integration_time/gpio_io_o] [get_bd_pins start_0/integration_time]
connect_bd_net [get_bd_pins proc_sys_reset_1/peripheral_aresetn] \
  [get_bd_pins axis_data_fifo_ch1/s_axis_aresetn] [get_bd_pins axis_data_fifo_ch2/s_axis_aresetn] \
  [get_bd_pins axis_data_fifo_ch3/s_axis_aresetn] [get_bd_pins axis_data_fifo_ch4/s_axis_aresetn] \
  [get_bd_pins axis_data_fifo_ch5/s_axis_aresetn] [get_bd_pins axis_data_fifo_ch6/s_axis_aresetn] \
  [get_bd_pins axis_data_fifo_ch7/s_axis_aresetn] [get_bd_pins axis_data_fifo_ch8/s_axis_aresetn]
connect_bd_net [get_bd_pins processing_system7_0/ENET0_GMII_TXD] [get_bd_pins xlslice_0/Din]
connect_bd_net [get_bd_pins processing_system7_0/ENET0_GMII_TX_EN] [get_bd_ports ENET0_GMII_TX_EN_0]
connect_bd_net [get_bd_pins processing_system7_0/FCLK_CLK0] \
  [get_bd_pins rst_ps7_0_50M/slowest_sync_clk] [get_bd_pins axi_smc/aclk] [get_bd_pins processing_system7_0/M_AXI_GP0_ACLK] \
  [get_bd_pins delay_ch1/s_axi_aclk] [get_bd_pins resetcount/s_axi_aclk] [get_bd_pins time_window/s_axi_aclk] \
  [get_bd_pins delay_ch2/s_axi_aclk] [get_bd_pins delay_out/s_axi_aclk] [get_bd_pins count1_2/s_axi_aclk] \
  [get_bd_pins AFGtrigger/s_axi_aclk] [get_bd_pins axi_intc_0/s_axi_aclk] [get_bd_pins delay_ch3/s_axi_aclk] \
  [get_bd_pins count3_4/s_axi_aclk] [get_bd_pins count5_6/s_axi_aclk] [get_bd_pins count7_8/s_axi_aclk] \
  [get_bd_pins delay_ch4/s_axi_aclk] [get_bd_pins delay_ch5/s_axi_aclk] [get_bd_pins delay_ch6/s_axi_aclk] \
  [get_bd_pins delay_ch7/s_axi_aclk] [get_bd_pins delay_ch8/s_axi_aclk] [get_bd_pins co_count1_5_6/s_axi_aclk] \
  [get_bd_pins co_count1_7_8/s_axi_aclk] [get_bd_pins co_count2_5_6/s_axi_aclk] [get_bd_pins co_count2_7_8/s_axi_aclk] \
  [get_bd_pins co_count3_5_6/s_axi_aclk] [get_bd_pins co_count3_7_8/s_axi_aclk] [get_bd_pins co_count4_5_6/s_axi_aclk] \
  [get_bd_pins co_count4_7_8/s_axi_aclk] [get_bd_pins integration_time/s_axi_aclk] [get_bd_pins reset/s_axi_aclk] \
  [get_bd_pins system_ila_0/clk]
connect_bd_net [get_bd_pins processing_system7_0/FCLK_CLK1] \
  [get_bd_pins proc_sys_reset_1/slowest_sync_clk] [get_bd_pins axis_data_fifo_ch1/s_axis_aclk] \
  [get_bd_pins axis_data_fifo_ch2/s_axis_aclk] [get_bd_pins axis_data_fifo_ch3/s_axis_aclk] \
  [get_bd_pins axis_data_fifo_ch4/s_axis_aclk] [get_bd_pins axis_data_fifo_ch5/s_axis_aclk] \
  [get_bd_pins axis_data_fifo_ch6/s_axis_aclk] [get_bd_pins axis_data_fifo_ch7/s_axis_aclk] \
  [get_bd_pins axis_data_fifo_ch8/s_axis_aclk] [get_bd_pins coincidencecounter_0/clk_250mhz] [get_bd_pins start_0/clk_250mhz]
connect_bd_net [get_bd_pins processing_system7_0/FCLK_RESET0_N] \
  [get_bd_pins rst_ps7_0_50M/ext_reset_in] [get_bd_pins proc_sys_reset_0/ext_reset_in] \
  [get_bd_pins proc_sys_reset_1/ext_reset_in]
connect_bd_net [get_bd_pins reset/gpio_io_o] [get_bd_pins start_0/reset_ext]
connect_bd_net [get_bd_pins resetcount/gpio_io_o] [get_bd_pins coincidencecounter_0/reset]
connect_bd_net [get_bd_pins rst_ps7_0_50M/peripheral_aresetn] \
  [get_bd_pins delay_ch1/s_axi_aresetn] [get_bd_pins delay_out/s_axi_aresetn] [get_bd_pins AFGtrigger/s_axi_aresetn] \
  [get_bd_pins count1_2/s_axi_aresetn] [get_bd_pins resetcount/s_axi_aresetn] [get_bd_pins time_window/s_axi_aresetn] \
  [get_bd_pins delay_ch2/s_axi_aresetn] [get_bd_pins axi_smc/aresetn] [get_bd_pins axi_intc_0/s_axi_aresetn] \
  [get_bd_pins delay_ch3/s_axi_aresetn] [get_bd_pins count3_4/s_axi_aresetn] [get_bd_pins count5_6/s_axi_aresetn] \
  [get_bd_pins count7_8/s_axi_aresetn] [get_bd_pins delay_ch4/s_axi_aresetn] [get_bd_pins delay_ch5/s_axi_aresetn] \
  [get_bd_pins delay_ch6/s_axi_aresetn] [get_bd_pins delay_ch7/s_axi_aresetn] [get_bd_pins delay_ch8/s_axi_aresetn] \
  [get_bd_pins co_count1_5_6/s_axi_aresetn] [get_bd_pins co_count1_7_8/s_axi_aresetn] \
  [get_bd_pins co_count2_5_6/s_axi_aresetn] [get_bd_pins co_count2_7_8/s_axi_aresetn] \
  [get_bd_pins co_count3_5_6/s_axi_aresetn] [get_bd_pins co_count3_7_8/s_axi_aresetn] \
  [get_bd_pins co_count4_5_6/s_axi_aresetn] [get_bd_pins co_count4_7_8/s_axi_aresetn] \
  [get_bd_pins integration_time/s_axi_aresetn] [get_bd_pins reset/s_axi_aresetn]
# net start_0_ScopeChannel3 has one end: ScopeChannel3
connect_bd_net [get_bd_pins start_0/ch1_data_valid] [get_bd_pins axis_data_fifo_ch1/s_axis_tvalid]
connect_bd_net [get_bd_pins start_0/ch1_t_last] [get_bd_pins axis_data_fifo_ch1/s_axis_tlast]
connect_bd_net [get_bd_pins start_0/ch2_data_valid] [get_bd_pins axis_data_fifo_ch2/s_axis_tvalid]
connect_bd_net [get_bd_pins start_0/ch2_t_last] [get_bd_pins axis_data_fifo_ch2/s_axis_tlast]
connect_bd_net [get_bd_pins start_0/ch3_data_valid] [get_bd_pins axis_data_fifo_ch3/s_axis_tvalid]
connect_bd_net [get_bd_pins start_0/ch3_t_last] [get_bd_pins axis_data_fifo_ch3/s_axis_tlast]
connect_bd_net [get_bd_pins start_0/ch4_data_valid] [get_bd_pins axis_data_fifo_ch4/s_axis_tvalid]
connect_bd_net [get_bd_pins start_0/ch4_t_last] [get_bd_pins axis_data_fifo_ch4/s_axis_tlast]
connect_bd_net [get_bd_pins start_0/ch5_data_valid] [get_bd_pins axis_data_fifo_ch5/s_axis_tvalid]
connect_bd_net [get_bd_pins start_0/ch5_t_last] [get_bd_pins axis_data_fifo_ch5/s_axis_tlast]
connect_bd_net [get_bd_pins start_0/ch6_data_valid] [get_bd_pins axis_data_fifo_ch6/s_axis_tvalid]
connect_bd_net [get_bd_pins start_0/ch6_t_last] [get_bd_pins axis_data_fifo_ch6/s_axis_tlast]
connect_bd_net [get_bd_pins start_0/ch7_data_valid] [get_bd_pins axis_data_fifo_ch7/s_axis_tvalid]
connect_bd_net [get_bd_pins start_0/ch7_t_last] [get_bd_pins axis_data_fifo_ch7/s_axis_tlast]
connect_bd_net [get_bd_pins start_0/ch8_data_valid] [get_bd_pins axis_data_fifo_ch8/s_axis_tvalid]
connect_bd_net [get_bd_pins start_0/ch8_t_last] [get_bd_pins axis_data_fifo_ch8/s_axis_tlast]
connect_bd_net [get_bd_pins start_0/count_ch1] [get_bd_pins count1_2/gpio_io_i]
connect_bd_net [get_bd_pins start_0/count_ch2] [get_bd_pins count1_2/gpio2_io_i]
connect_bd_net [get_bd_pins start_0/count_ch3] [get_bd_pins count3_4/gpio_io_i]
connect_bd_net [get_bd_pins start_0/count_ch4] [get_bd_pins count3_4/gpio2_io_i]
connect_bd_net [get_bd_pins start_0/count_ch5] [get_bd_pins count5_6/gpio_io_i]
connect_bd_net [get_bd_pins start_0/count_ch6] [get_bd_pins count5_6/gpio2_io_i]
connect_bd_net [get_bd_pins start_0/count_ch7] [get_bd_pins count7_8/gpio_io_i]
connect_bd_net [get_bd_pins start_0/count_ch8] [get_bd_pins count7_8/gpio2_io_i]
connect_bd_net [get_bd_pins start_0/delay_ch1_out] [get_bd_pins delay_out/gpio_io_i]
connect_bd_net [get_bd_pins start_0/delay_ch2_out] [get_bd_pins delay_out/gpio2_io_i]
connect_bd_net -net start_0_green [get_bd_pins start_0/led_green] [get_bd_ports green]
# net start_0_new_time has one end: start_0/new_time
connect_bd_net -net start_0_new_time_ch1 [get_bd_pins start_0/new_time_ch1] \
  [get_bd_pins coincidencecounter_0/new_time_ch1] [get_bd_pins system_ila_0/probe8]
connect_bd_net -net start_0_new_time_ch2 [get_bd_pins start_0/new_time_ch2] \
  [get_bd_pins coincidencecounter_0/new_time_ch2] [get_bd_pins system_ila_0/probe9]
connect_bd_net -net start_0_new_time_ch3 [get_bd_pins start_0/new_time_ch3] \
  [get_bd_pins coincidencecounter_0/new_time_ch3] [get_bd_pins system_ila_0/probe10]
connect_bd_net -net start_0_new_time_ch4 [get_bd_pins start_0/new_time_ch4] \
  [get_bd_pins coincidencecounter_0/new_time_ch4] [get_bd_pins system_ila_0/probe11]
connect_bd_net -net start_0_new_time_ch5 [get_bd_pins start_0/new_time_ch5] \
  [get_bd_pins coincidencecounter_0/new_time_ch5] [get_bd_pins system_ila_0/probe12]
connect_bd_net -net start_0_new_time_ch6 [get_bd_pins start_0/new_time_ch6] \
  [get_bd_pins coincidencecounter_0/new_time_ch6] [get_bd_pins system_ila_0/probe13]
connect_bd_net -net start_0_new_time_ch7 [get_bd_pins start_0/new_time_ch7] \
  [get_bd_pins coincidencecounter_0/new_time_ch7] [get_bd_pins system_ila_0/probe14]
connect_bd_net -net start_0_new_time_ch8 [get_bd_pins start_0/new_time_ch8] \
  [get_bd_pins coincidencecounter_0/new_time_ch8] [get_bd_pins system_ila_0/probe15]
connect_bd_net -net start_0_red [get_bd_pins start_0/led_red] [get_bd_ports red]
connect_bd_net [get_bd_pins start_0/time_ch1_dma] [get_bd_pins axis_data_fifo_ch1/s_axis_tdata]
connect_bd_net -net start_0_time_ch1_out [get_bd_pins start_0/time_ch1] [get_bd_pins coincidencecounter_0/time_ch1]
connect_bd_net [get_bd_pins start_0/time_ch2_dma] [get_bd_pins axis_data_fifo_ch2/s_axis_tdata]
connect_bd_net -net start_0_time_ch2_out [get_bd_pins start_0/time_ch2] [get_bd_pins coincidencecounter_0/time_ch2]
connect_bd_net [get_bd_pins start_0/time_ch3_dma] [get_bd_pins axis_data_fifo_ch3/s_axis_tdata]
connect_bd_net -net start_0_time_ch3_out [get_bd_pins start_0/time_ch3] [get_bd_pins coincidencecounter_0/time_ch3]
connect_bd_net [get_bd_pins start_0/time_ch4_dma] [get_bd_pins axis_data_fifo_ch4/s_axis_tdata]
connect_bd_net -net start_0_time_ch4_out [get_bd_pins start_0/time_ch4] [get_bd_pins coincidencecounter_0/time_ch4]
connect_bd_net [get_bd_pins start_0/time_ch5_dma] [get_bd_pins axis_data_fifo_ch5/s_axis_tdata]
connect_bd_net -net start_0_time_ch5_out [get_bd_pins start_0/time_ch5] [get_bd_pins coincidencecounter_0/time_ch5]
connect_bd_net [get_bd_pins start_0/time_ch6_dma] [get_bd_pins axis_data_fifo_ch6/s_axis_tdata]
connect_bd_net -net start_0_time_ch6_out [get_bd_pins start_0/time_ch6] [get_bd_pins coincidencecounter_0/time_ch6]
connect_bd_net [get_bd_pins start_0/time_ch7_dma] [get_bd_pins axis_data_fifo_ch7/s_axis_tdata]
connect_bd_net -net start_0_time_ch7_out [get_bd_pins start_0/time_ch7] [get_bd_pins coincidencecounter_0/time_ch7]
connect_bd_net [get_bd_pins start_0/time_ch8_dma] [get_bd_pins axis_data_fifo_ch8/s_axis_tdata]
connect_bd_net -net start_0_time_ch8_out [get_bd_pins start_0/time_ch8] [get_bd_pins coincidencecounter_0/time_ch8]
connect_bd_net [get_bd_pins time_window/gpio_io_o] [get_bd_pins coincidencecounter_0/time_window]
connect_bd_net [get_bd_pins xlconcat_0/dout] [get_bd_pins processing_system7_0/ENET0_GMII_RXD]
connect_bd_net [get_bd_pins xlslice_0/Dout] [get_bd_ports enet0_gmii_txd]
set_property HDL_ATTRIBUTE.DEBUG true [get_bd_nets axis_data_fifo_0_s_axis_tready]
set_property HDL_ATTRIBUTE.MARK_DEBUG true [get_bd_nets axis_data_fifo_0_s_axis_tready]
set_property HDL_ATTRIBUTE.DEBUG true [get_bd_nets axis_data_fifo_ch3_s_axis_tready]
set_property HDL_ATTRIBUTE.MARK_DEBUG true [get_bd_nets axis_data_fifo_ch3_s_axis_tready]
set_property HDL_ATTRIBUTE.DEBUG true [get_bd_nets ch1_0_1]
set_property HDL_ATTRIBUTE.MARK_DEBUG true [get_bd_nets ch1_0_1]
set_property HDL_ATTRIBUTE.DEBUG true [get_bd_nets ch3_0_1]
set_property HDL_ATTRIBUTE.MARK_DEBUG true [get_bd_nets ch3_0_1]
set_property HDL_ATTRIBUTE.DEBUG true [get_bd_nets ch4_0_1]
set_property HDL_ATTRIBUTE.MARK_DEBUG true [get_bd_nets ch4_0_1]
set_property HDL_ATTRIBUTE.DEBUG true [get_bd_nets ch5_0_1]
set_property HDL_ATTRIBUTE.MARK_DEBUG true [get_bd_nets ch5_0_1]
set_property HDL_ATTRIBUTE.DEBUG true [get_bd_nets ch6_0_1]
set_property HDL_ATTRIBUTE.MARK_DEBUG true [get_bd_nets ch6_0_1]
set_property HDL_ATTRIBUTE.DEBUG true [get_bd_nets ch7_0_1]
set_property HDL_ATTRIBUTE.MARK_DEBUG true [get_bd_nets ch7_0_1]
set_property HDL_ATTRIBUTE.DEBUG true [get_bd_nets ch8_0_1]
set_property HDL_ATTRIBUTE.MARK_DEBUG true [get_bd_nets ch8_0_1]
set_property HDL_ATTRIBUTE.DEBUG true [get_bd_nets start_0_new_time_ch1]
set_property HDL_ATTRIBUTE.MARK_DEBUG true [get_bd_nets start_0_new_time_ch1]
set_property HDL_ATTRIBUTE.DEBUG true [get_bd_nets start_0_new_time_ch2]
set_property HDL_ATTRIBUTE.MARK_DEBUG true [get_bd_nets start_0_new_time_ch2]
set_property HDL_ATTRIBUTE.DEBUG true [get_bd_nets start_0_new_time_ch3]
set_property HDL_ATTRIBUTE.MARK_DEBUG true [get_bd_nets start_0_new_time_ch3]
set_property HDL_ATTRIBUTE.DEBUG true [get_bd_nets start_0_new_time_ch4]
set_property HDL_ATTRIBUTE.MARK_DEBUG true [get_bd_nets start_0_new_time_ch4]
set_property HDL_ATTRIBUTE.DEBUG true [get_bd_nets start_0_new_time_ch5]
set_property HDL_ATTRIBUTE.MARK_DEBUG true [get_bd_nets start_0_new_time_ch5]
set_property HDL_ATTRIBUTE.DEBUG true [get_bd_nets start_0_new_time_ch6]
set_property HDL_ATTRIBUTE.MARK_DEBUG true [get_bd_nets start_0_new_time_ch6]
set_property HDL_ATTRIBUTE.DEBUG true [get_bd_nets start_0_new_time_ch7]
set_property HDL_ATTRIBUTE.MARK_DEBUG true [get_bd_nets start_0_new_time_ch7]
set_property HDL_ATTRIBUTE.DEBUG true [get_bd_nets start_0_new_time_ch8]
set_property HDL_ATTRIBUTE.MARK_DEBUG true [get_bd_nets start_0_new_time_ch8]

# ---- address map ----
assign_bd_address -offset 0x00000000 -range 128M -target_address_space [get_bd_addr_spaces axi_dma/Data_MM2S] [get_bd_addr_segs processing_system7_0/S_AXI_HP0/HP0_DDR_LOWOCM]
assign_bd_address -offset 0x08000000 -range 128M -target_address_space [get_bd_addr_spaces axi_dma/Data_MM2S] [get_bd_addr_segs processing_system7_0/S_AXI_HP2/HP2_DDR_LOWOCM]
assign_bd_address -offset 0x00000000 -range 128M -target_address_space [get_bd_addr_spaces axi_dma/Data_S2MM] [get_bd_addr_segs processing_system7_0/S_AXI_HP0/HP0_DDR_LOWOCM]
assign_bd_address -offset 0x08000000 -range 128M -target_address_space [get_bd_addr_spaces axi_dma/Data_S2MM] [get_bd_addr_segs processing_system7_0/S_AXI_HP2/HP2_DDR_LOWOCM]
assign_bd_address -offset 0x00000000 -range 128M -target_address_space [get_bd_addr_spaces axi_dma/Data_SG] [get_bd_addr_segs processing_system7_0/S_AXI_HP0/HP0_DDR_LOWOCM]
assign_bd_address -offset 0x08000000 -range 128M -target_address_space [get_bd_addr_spaces axi_dma/Data_SG] [get_bd_addr_segs processing_system7_0/S_AXI_HP2/HP2_DDR_LOWOCM]
assign_bd_address -offset 0x40400000 -range 64K -target_address_space [get_bd_addr_spaces processing_system7_0/Data] [get_bd_addr_segs axi_dma/S_AXI_LITE/Reg]
assign_bd_address -offset 0x41200000 -range 64K -target_address_space [get_bd_addr_spaces processing_system7_0/Data] [get_bd_addr_segs AFGtrigger/S_AXI/Reg]
assign_bd_address -offset 0x41210000 -range 64K -target_address_space [get_bd_addr_spaces processing_system7_0/Data] [get_bd_addr_segs count1_2/S_AXI/Reg]
assign_bd_address -offset 0x41220000 -range 64K -target_address_space [get_bd_addr_spaces processing_system7_0/Data] [get_bd_addr_segs resetcount/S_AXI/Reg]
assign_bd_address -offset 0x41230000 -range 64K -target_address_space [get_bd_addr_spaces processing_system7_0/Data] [get_bd_addr_segs delay_ch3/S_AXI/Reg]
assign_bd_address -offset 0x41240000 -range 64K -target_address_space [get_bd_addr_spaces processing_system7_0/Data] [get_bd_addr_segs delay_ch1/S_AXI/Reg]
assign_bd_address -offset 0x41260000 -range 64K -target_address_space [get_bd_addr_spaces processing_system7_0/Data] [get_bd_addr_segs count3_4/S_AXI/Reg]
assign_bd_address -offset 0x41270000 -range 64K -target_address_space [get_bd_addr_spaces processing_system7_0/Data] [get_bd_addr_segs time_window/S_AXI/Reg]
assign_bd_address -offset 0x41280000 -range 64K -target_address_space [get_bd_addr_spaces processing_system7_0/Data] [get_bd_addr_segs count5_6/S_AXI/Reg]
assign_bd_address -offset 0x41290000 -range 64K -target_address_space [get_bd_addr_spaces processing_system7_0/Data] [get_bd_addr_segs delay_out/S_AXI/Reg]
assign_bd_address -offset 0x412A0000 -range 64K -target_address_space [get_bd_addr_spaces processing_system7_0/Data] [get_bd_addr_segs count7_8/S_AXI/Reg]
assign_bd_address -offset 0x412B0000 -range 64K -target_address_space [get_bd_addr_spaces processing_system7_0/Data] [get_bd_addr_segs delay_ch2/S_AXI/Reg]
assign_bd_address -offset 0x412C0000 -range 64K -target_address_space [get_bd_addr_spaces processing_system7_0/Data] [get_bd_addr_segs delay_ch4/S_AXI/Reg]
assign_bd_address -offset 0x412D0000 -range 64K -target_address_space [get_bd_addr_spaces processing_system7_0/Data] [get_bd_addr_segs delay_ch5/S_AXI/Reg]
assign_bd_address -offset 0x412E0000 -range 64K -target_address_space [get_bd_addr_spaces processing_system7_0/Data] [get_bd_addr_segs delay_ch6/S_AXI/Reg]
assign_bd_address -offset 0x412F0000 -range 64K -target_address_space [get_bd_addr_spaces processing_system7_0/Data] [get_bd_addr_segs delay_ch7/S_AXI/Reg]
assign_bd_address -offset 0x41300000 -range 64K -target_address_space [get_bd_addr_spaces processing_system7_0/Data] [get_bd_addr_segs delay_ch8/S_AXI/Reg]
assign_bd_address -offset 0x41310000 -range 64K -target_address_space [get_bd_addr_spaces processing_system7_0/Data] [get_bd_addr_segs co_count1_5_6/S_AXI/Reg]
assign_bd_address -offset 0x41320000 -range 64K -target_address_space [get_bd_addr_spaces processing_system7_0/Data] [get_bd_addr_segs co_count1_7_8/S_AXI/Reg]
assign_bd_address -offset 0x41330000 -range 64K -target_address_space [get_bd_addr_spaces processing_system7_0/Data] [get_bd_addr_segs co_count2_5_6/S_AXI/Reg]
assign_bd_address -offset 0x41340000 -range 64K -target_address_space [get_bd_addr_spaces processing_system7_0/Data] [get_bd_addr_segs co_count2_7_8/S_AXI/Reg]
assign_bd_address -offset 0x41350000 -range 64K -target_address_space [get_bd_addr_spaces processing_system7_0/Data] [get_bd_addr_segs co_count3_5_6/S_AXI/Reg]
assign_bd_address -offset 0x41360000 -range 64K -target_address_space [get_bd_addr_spaces processing_system7_0/Data] [get_bd_addr_segs co_count3_7_8/S_AXI/Reg]
assign_bd_address -offset 0x41370000 -range 64K -target_address_space [get_bd_addr_spaces processing_system7_0/Data] [get_bd_addr_segs co_count4_5_6/S_AXI/Reg]
assign_bd_address -offset 0x41380000 -range 64K -target_address_space [get_bd_addr_spaces processing_system7_0/Data] [get_bd_addr_segs co_count4_7_8/S_AXI/Reg]
assign_bd_address -offset 0x41390000 -range 64K -target_address_space [get_bd_addr_spaces processing_system7_0/Data] [get_bd_addr_segs integration_time/S_AXI/Reg]
assign_bd_address -offset 0x413A0000 -range 64K -target_address_space [get_bd_addr_spaces processing_system7_0/Data] [get_bd_addr_segs reset/S_AXI/Reg]
assign_bd_address -offset 0x41800000 -range 64K -target_address_space [get_bd_addr_spaces processing_system7_0/Data] [get_bd_addr_segs axi_intc_0/S_AXI/Reg]

validate_bd_design
save_bd_design
